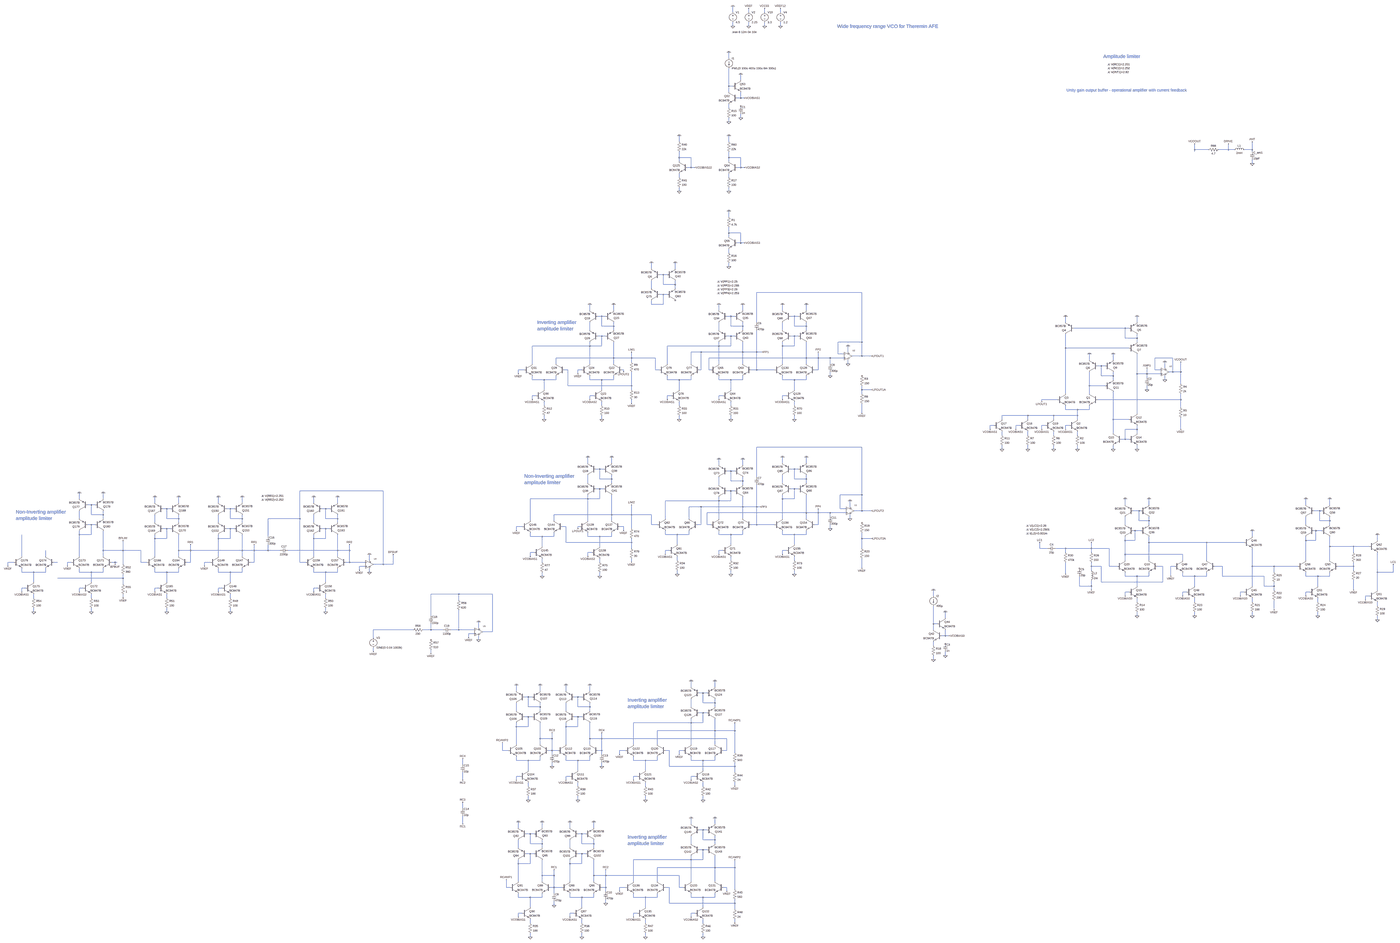
[diagram p0: schematic vco_sine_bjt_v10.asc, whole sheet]
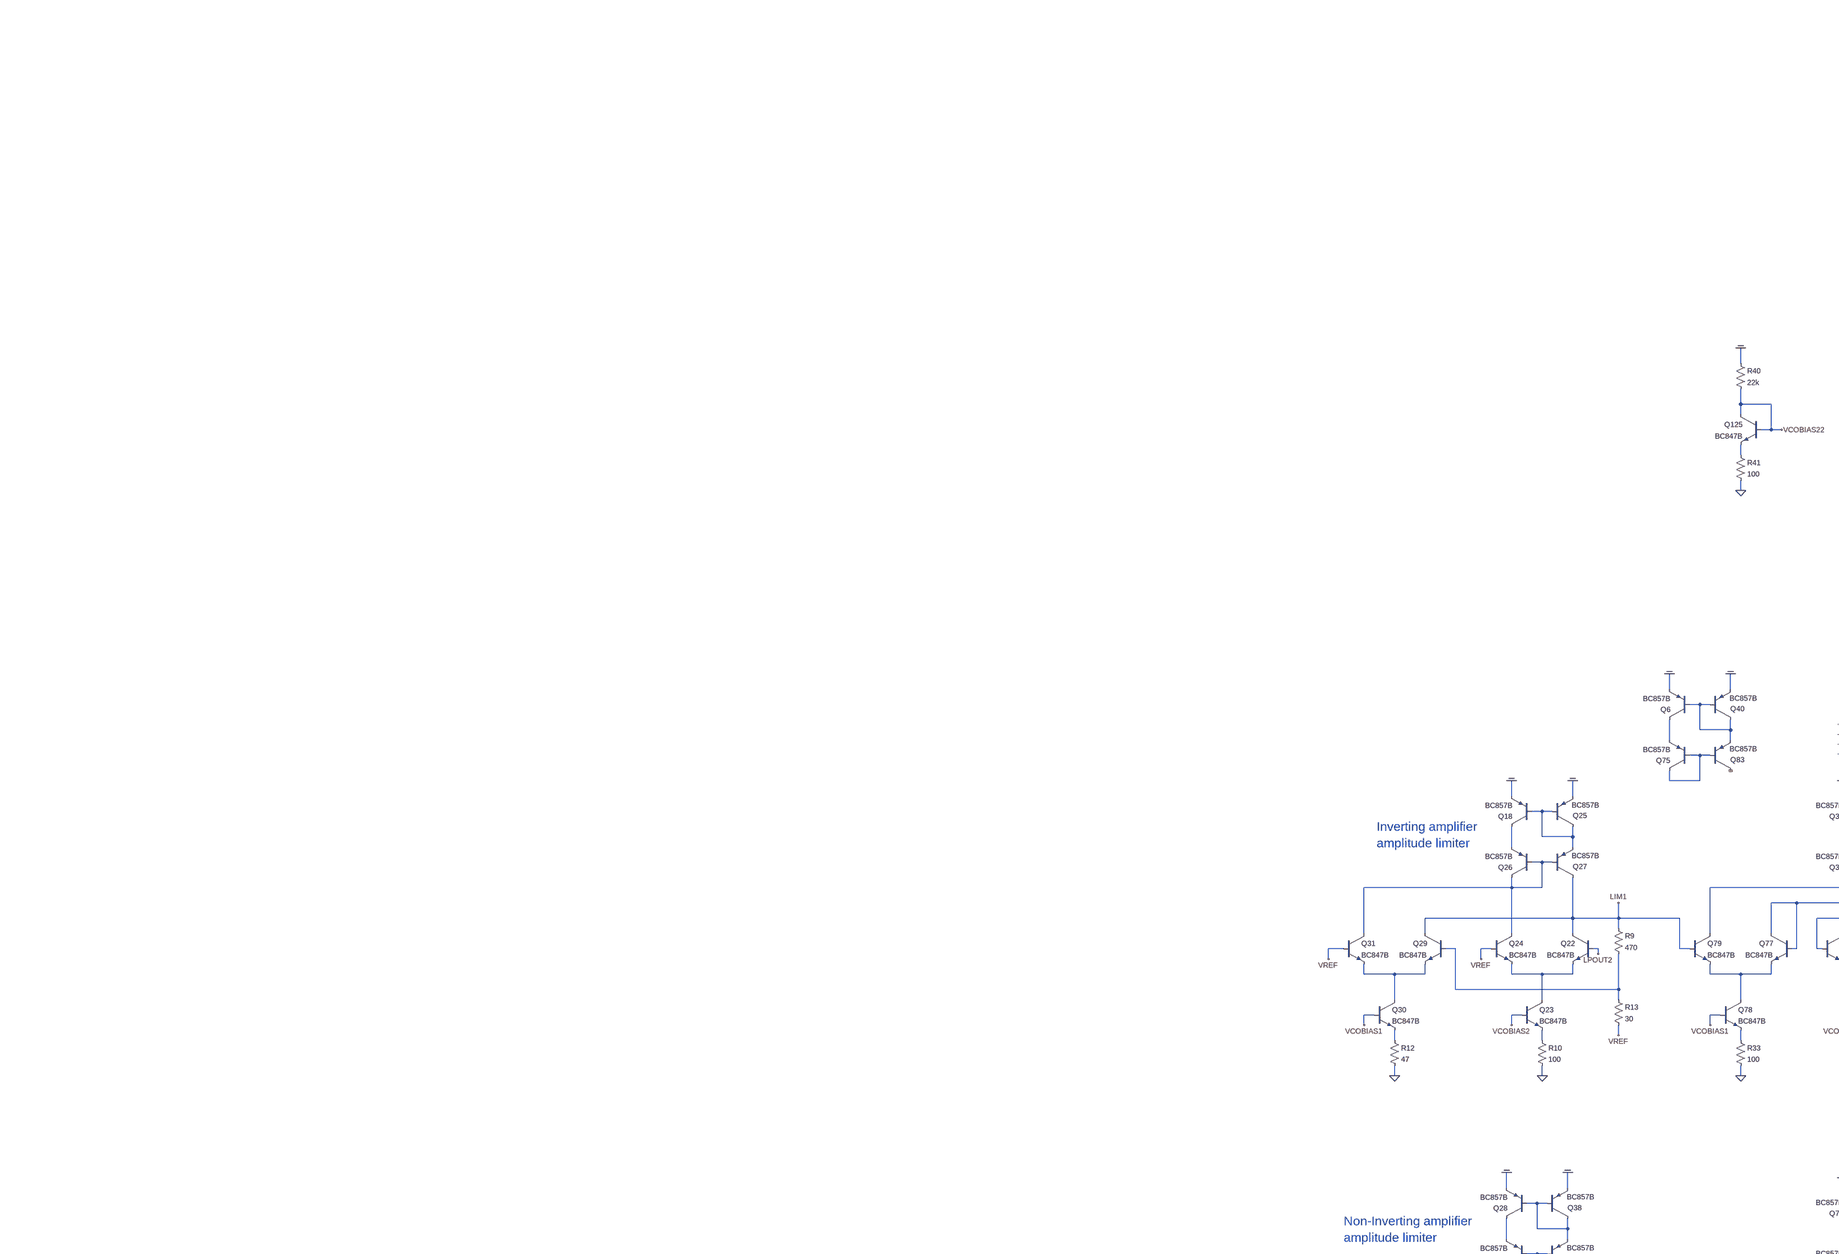
[diagram p1: schematic vco_sine_bjt_v10.asc, part, row 1 of 2, column 1 of 2]
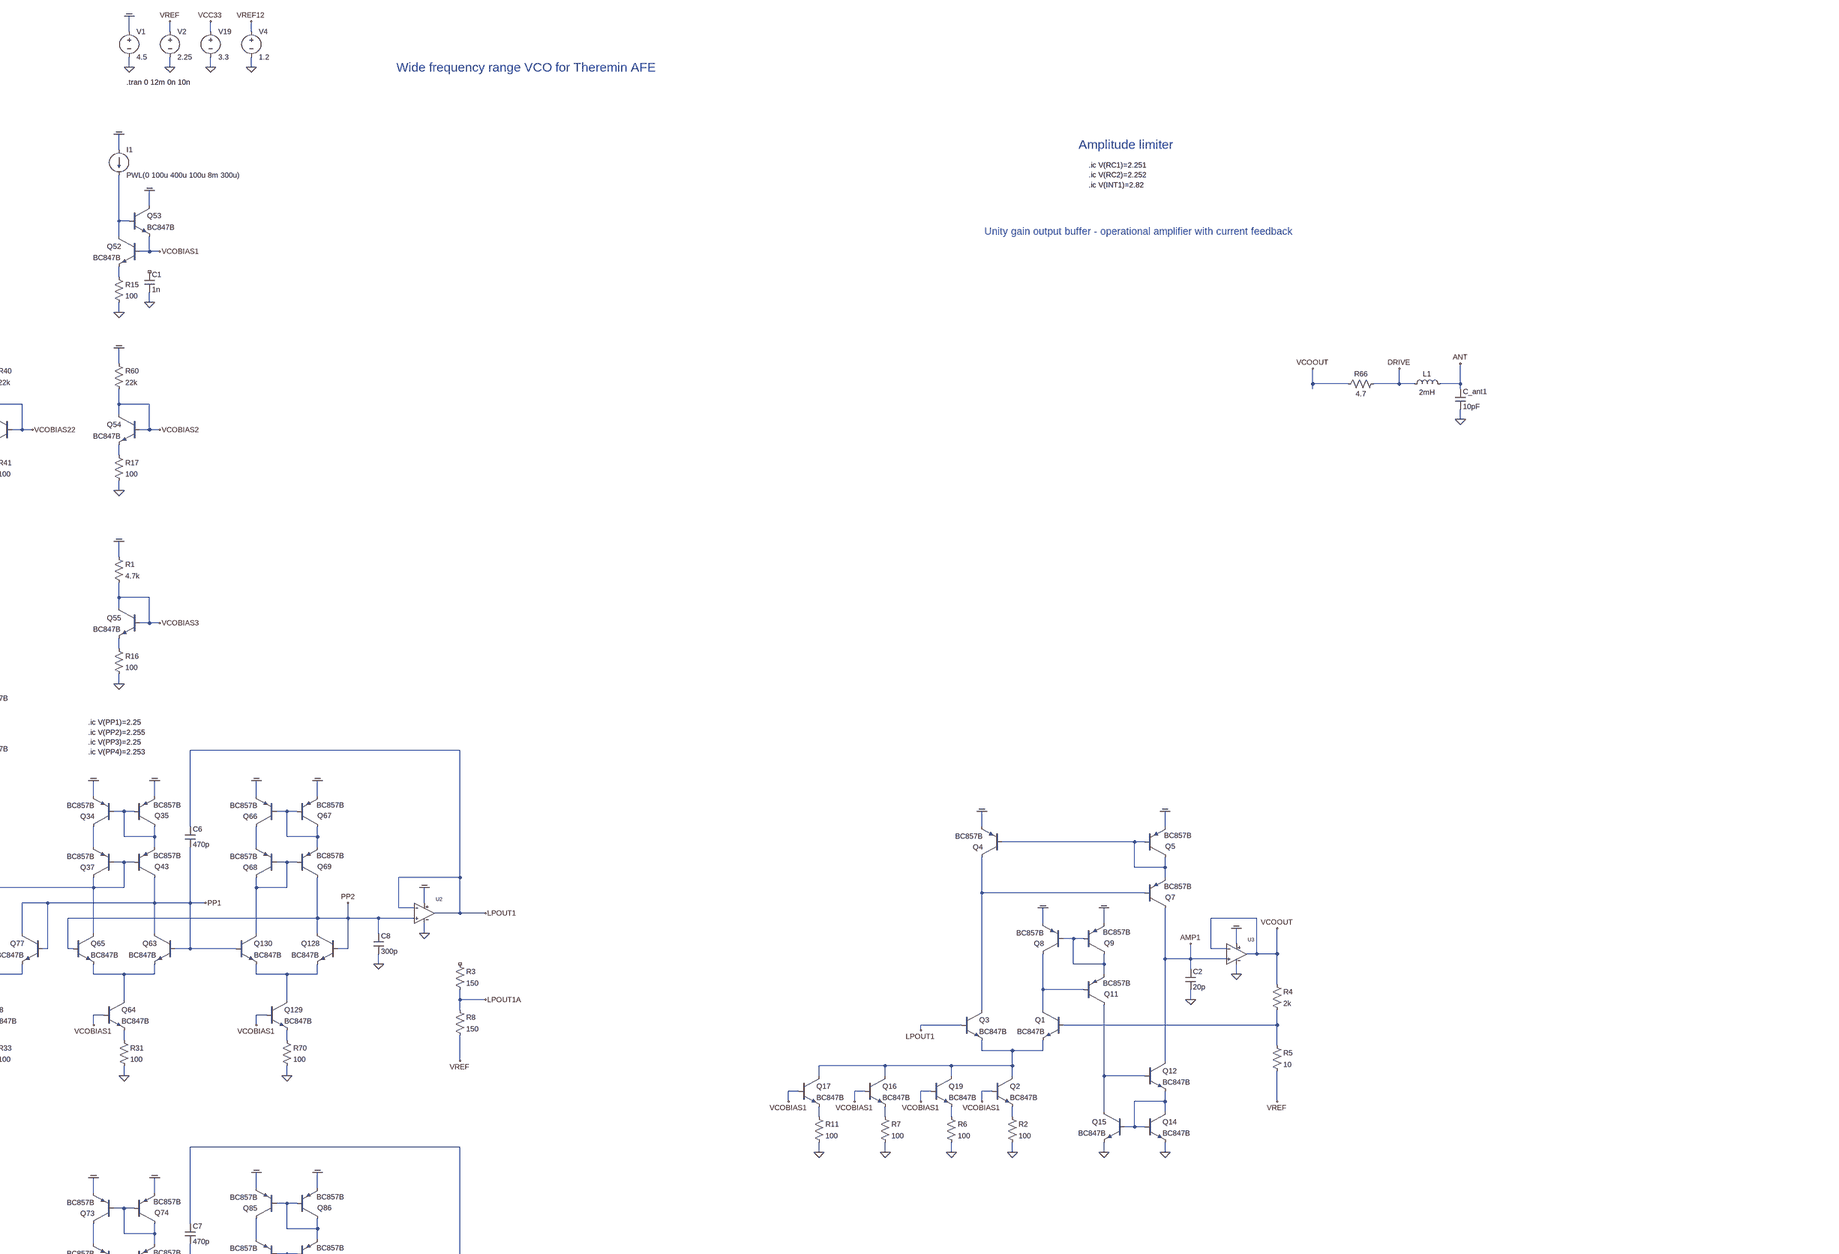
[diagram p2: schematic vco_sine_bjt_v10.asc, part, row 1 of 2, column 2 of 2]
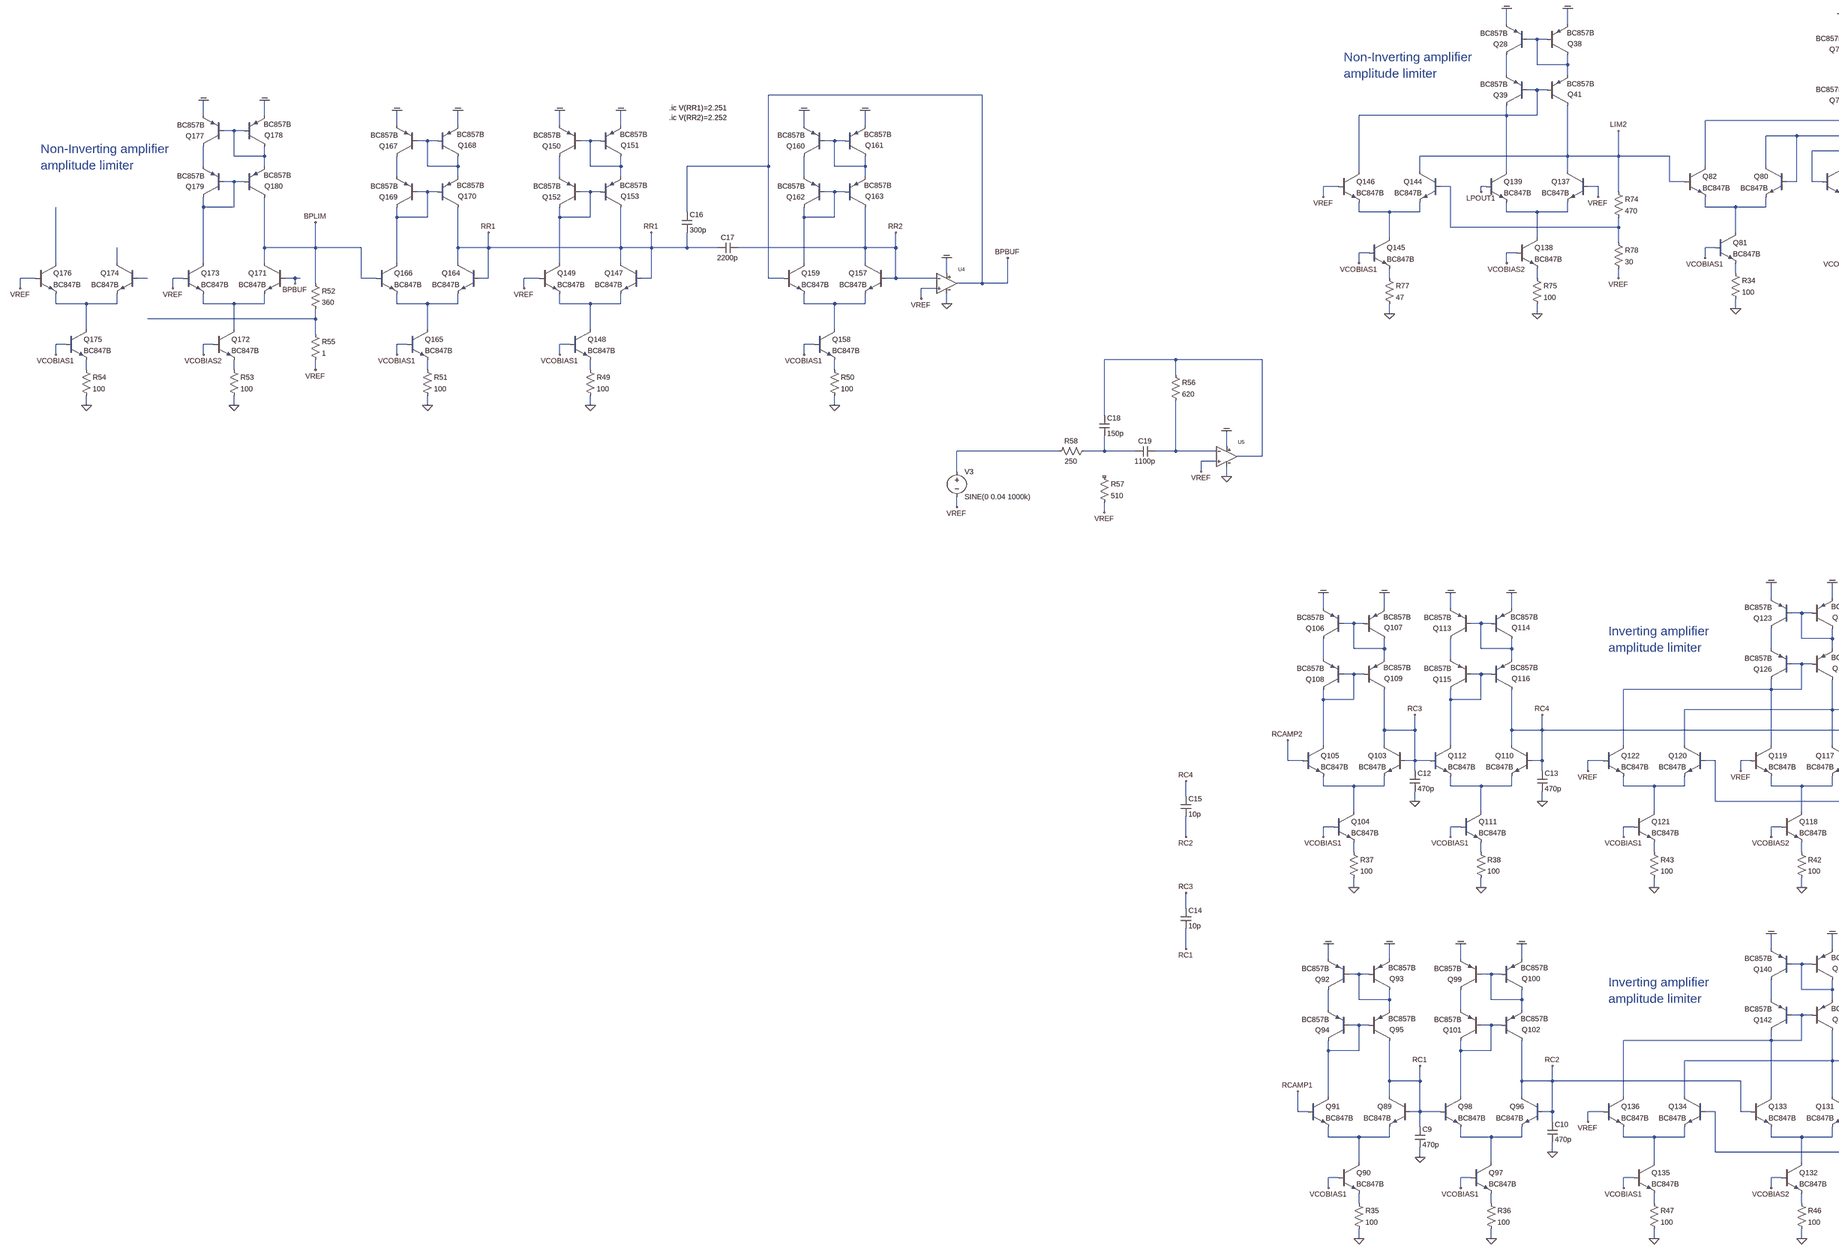
[diagram p3: schematic vco_sine_bjt_v10.asc, part, row 2 of 2, column 1 of 2]
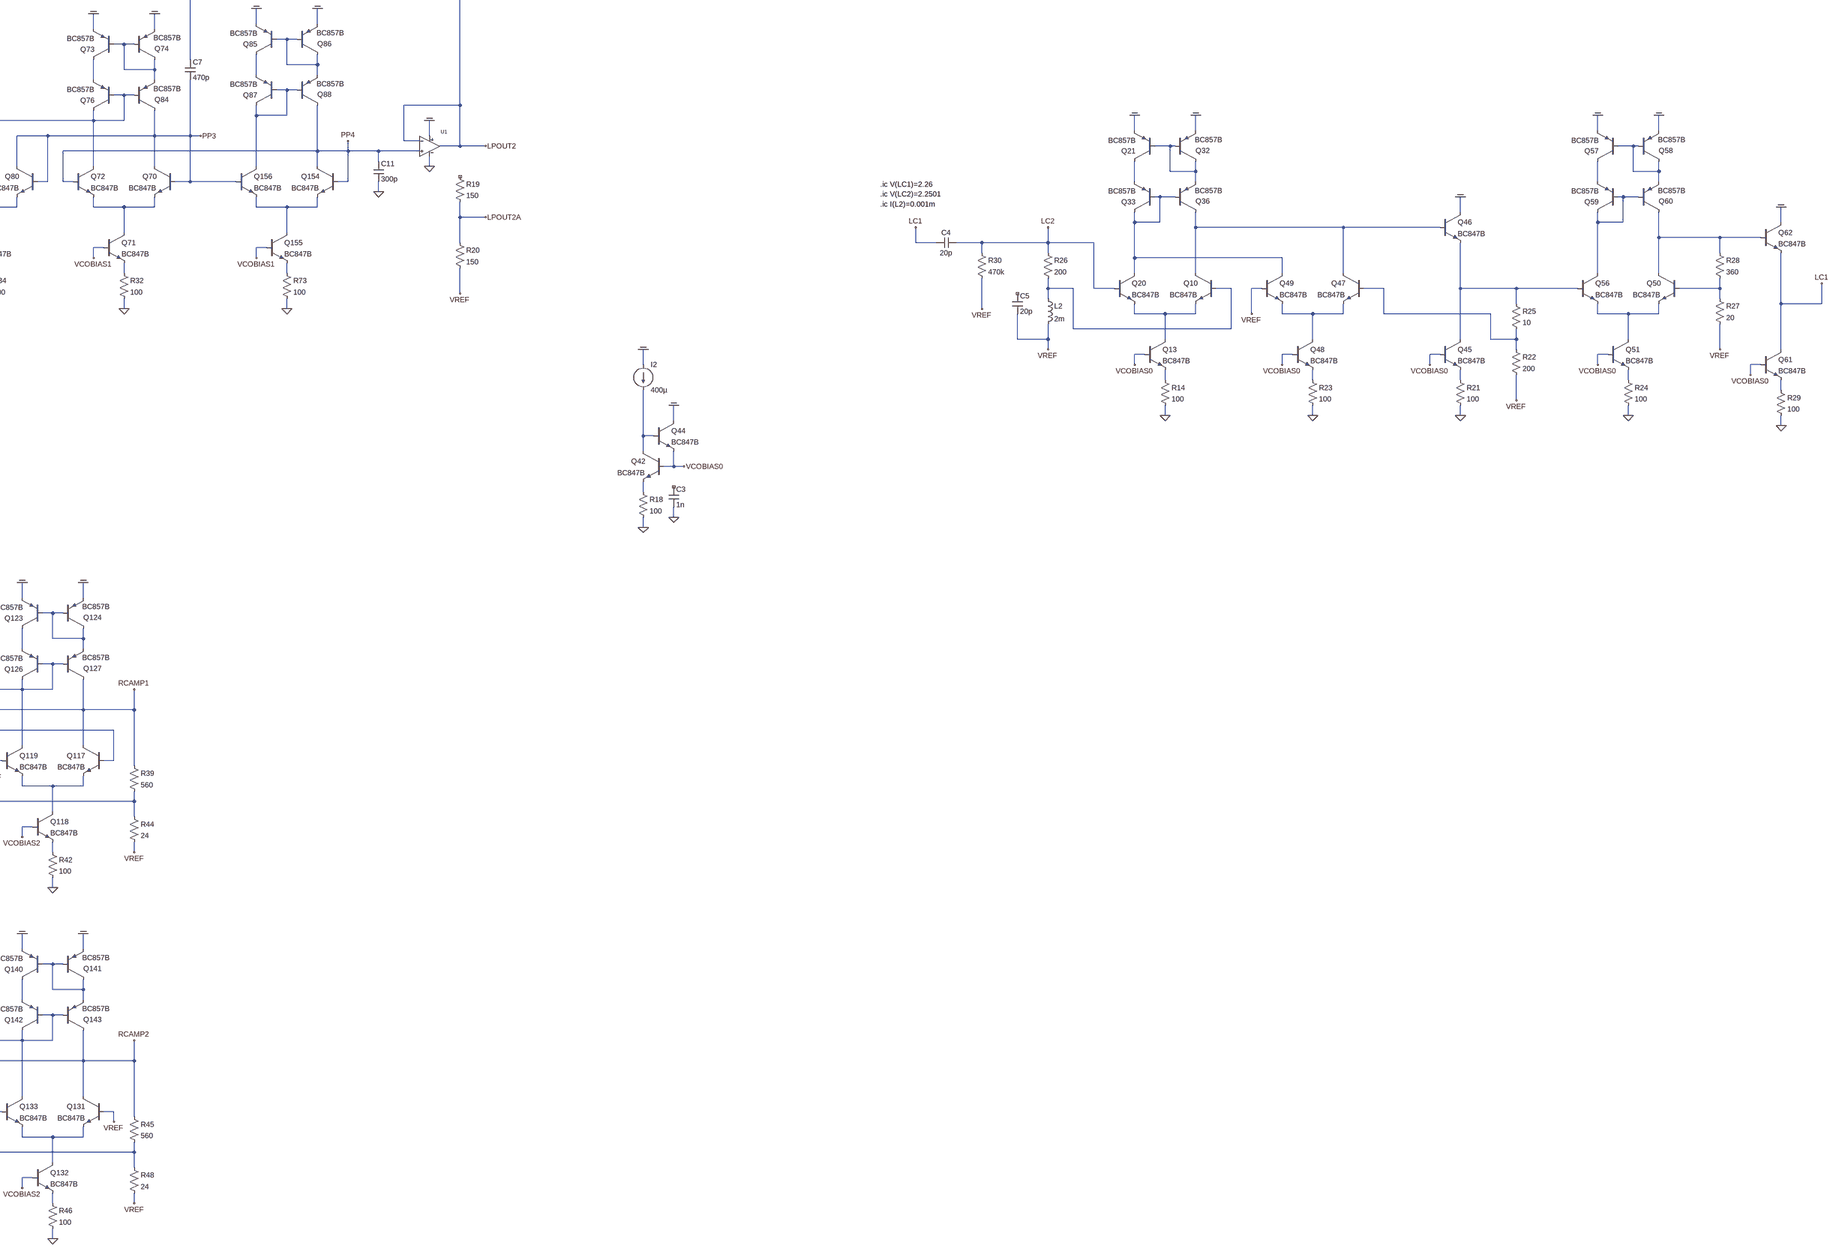
[diagram p4: schematic vco_sine_bjt_v10.asc, part, row 2 of 2, column 2 of 2]
* vco_sine_bjt_v10.asc
V1 COM 0 4.5
V2 VREF 0 2.25
V19 VCC33 0 3.3
V4 VREF12 0 1.2
Q52 N001 VCOBIAS1 N002 0 BC847B
R60 COM VCOBIAS2 22k
R1 COM VCOBIAS3 4.7k
I1 COM N001 PWL(0 100u 400u 100u 8m 300u)
Q54 VCOBIAS2 VCOBIAS2 N004 0 BC847B
Q55 VCOBIAS3 VCOBIAS3 N005 0 BC847B
Q53 COM N001 VCOBIAS1 0 BC847B
R15 N002 0 100
R16 N005 0 100
R17 N004 0 100
C1 NC_01 0 1n
R40 COM VCOBIAS22 22k
Q125 VCOBIAS22 VCOBIAS22 N003 0 BC847B
R41 N003 0 100
L1 DRIVE ANT 2mH Rser=120 Cpar=1pF
C_ant1 ANT 0 10pF
R66 VCOOUT DRIVE 4.7
Q128 PP2 PP2 N026 0 BC847B
Q129 N026 VCOBIAS1 N033 0 BC847B
Q130 N018 PP1 N026 0 BC847B
R70 N033 0 100
C8 PP2 0 300p
Q137 LIM2 VREF N073 0 BC847B
Q138 N073 VCOBIAS2 N083 0 BC847B
Q139 N047 LPOUT1 N073 0 BC847B
R74 LIM2 N063 470
R75 N083 0 100
Q144 LIM2 N063 N072 0 BC847B
Q145 N072 VCOBIAS1 N082 0 BC847B
Q146 N047 VREF N072 0 BC847B
R77 N082 0 47
R78 N063 VREF 30
Q154 PP4 PP4 N071 0 BC847B
Q155 N071 VCOBIAS1 N080 0 BC847B
Q156 N048 PP3 N071 0 BC847B
R73 N080 0 100
C11 PP4 0 300p
Q1 N027 N028 N034 0 BC847B
Q2 N034 VCOBIAS1 N040 0 BC847B
Q3 N019 LPOUT1 N034 0 BC847B
R2 N040 0 100
Q4 N019 N012 COM 0 BC857B
Q5 N012 N012 COM 0 BC857B
Q7 AMP1 N019 N012 0 BC857B
Q8 N027 N020 COM 0 BC857B
Q9 N020 N020 COM 0 BC857B
Q11 N035 N027 N020 0 BC857B
Q12 AMP1 N035 N036 0 BC847B
Q14 N036 N036 0 0 BC847B
Q15 N035 N036 0 0 BC847B
C2 AMP1 0 20p
R4 VCOOUT N028 2k
R5 N028 VREF 10
Q19 N034 VCOBIAS1 N039 0 BC847B
R6 N039 0 100
Q22 LIM1 LPOUT2 N023 0 BC847B
Q23 N023 VCOBIAS2 N030 0 BC847B
Q24 N016 VREF N023 0 BC847B
R9 LIM1 N021 470
R10 N030 0 100
Q29 LIM1 N021 N022 0 BC847B
Q30 N022 VCOBIAS1 N029 0 BC847B
Q31 N016 VREF N022 0 BC847B
R12 N029 0 47
R13 N021 VREF 30
XU1 PP4 LPOUT2 COM 0 LPOUT2 MCP6021  ; pins In+ In- V+ V- OUT
XU2 PP2 LPOUT1 COM 0 LPOUT1 MCP6021  ; pins In+ In- V+ V- OUT
XU3 AMP1 VCOOUT COM 0 VCOOUT MCP6021  ; pins In+ In- V+ V- OUT
R3 NC_02 LPOUT1A 150
R8 LPOUT1A VREF 150
Q16 N034 VCOBIAS1 N038 0 BC847B
R7 N038 0 100
Q17 N034 VCOBIAS1 N037 0 BC847B
R11 N037 0 100
R19 NC_03 LPOUT2A 150
R20 LPOUT2A VREF 150
Q10 N074 N084 N093 0 BC847B
Q13 N093 VCOBIAS0 N103 0 BC847B
Q20 N067 LC2 N093 0 BC847B
R14 N103 0 100
Q21 N061 N054 COM 0 BC857B
Q32 N054 N054 COM 0 BC857B
Q33 N067 N067 N061 0 BC857B
Q36 N074 N067 N054 0 BC857B
Q42 N108 VCOBIAS0 N112 0 BC847B
I2 COM N108 400µ
Q44 COM N108 VCOBIAS0 0 BC847B
R18 N112 0 100
C3 NC_04 0 1n
L2 N084 VREF 2m Rser=10 Cpar=1p
C4 LC2 LC1 20p
R26 LC2 N084 200
Q45 N086 VCOBIAS0 N105 0 BC847B
R21 N105 0 100
Q46 COM N074 N086 0 BC847B
Q47 N074 N085 N094 0 BC847B
Q48 N094 VCOBIAS0 N104 0 BC847B
Q49 N067 VREF N094 0 BC847B
R23 N104 0 100
Q50 N075 N087 N095 0 BC847B
Q51 N095 VCOBIAS0 N106 0 BC847B
Q56 N068 N086 N095 0 BC847B
R24 N106 0 100
Q57 N062 N055 COM 0 BC857B
Q58 N055 N055 COM 0 BC857B
Q59 N068 N068 N062 0 BC857B
Q60 N075 N068 N055 0 BC857B
R27 N087 VREF 20
R28 N075 N087 360
Q61 LC1 VCOBIAS0 N107 0 BC847B
R29 N107 0 100
Q62 COM N075 LC1 0 BC847B
R22 N085 VREF 200
R25 N086 N085 10
C5 NC_05 VREF 20p
R30 LC2 VREF 470k
Q63 PP1 PP1 N025 0 BC847B
Q64 N025 VCOBIAS1 N032 0 BC847B
Q65 N017 PP2 N025 0 BC847B
R31 N032 0 100
C6 LPOUT1 PP1 470p
Q70 PP3 PP3 N070 0 BC847B
Q71 N070 VCOBIAS1 N079 0 BC847B
Q72 N049 PP4 N070 0 BC847B
R32 N079 0 100
C7 LPOUT2 PP3 470p
Q77 PP1 PP1 N024 0 BC847B
Q78 N024 VCOBIAS1 N031 0 BC847B
Q79 N017 LIM1 N024 0 BC847B
R33 N031 0 100
Q80 PP3 PP3 N069 0 BC847B
Q81 N069 VCOBIAS1 N078 0 BC847B
Q82 N049 LIM2 N069 0 BC847B
R34 N078 0 100
Q6 N007 N006 COM 0 BC857B
Q40 N006 N006 COM 0 BC857B
Q75 N008 N008 N007 0 BC857B
Q83 NC_06 N008 N006 0 BC857B
Q18 N013 N009 COM 0 BC857B
Q25 N009 N009 COM 0 BC857B
Q26 N016 N016 N013 0 BC857B
Q27 LIM1 N016 N009 0 BC857B
Q34 N014 N010 COM 0 BC857B
Q35 N010 N010 COM 0 BC857B
Q37 N017 N017 N014 0 BC857B
Q43 PP1 N017 N010 0 BC857B
Q66 N015 N011 COM 0 BC857B
Q67 N011 N011 COM 0 BC857B
Q68 N018 N018 N015 0 BC857B
Q69 PP2 N018 N011 0 BC857B
Q28 N044 N041 COM 0 BC857B
Q38 N041 N041 COM 0 BC857B
Q39 N047 N047 N044 0 BC857B
Q41 LIM2 N047 N041 0 BC857B
Q73 N046 N043 COM 0 BC857B
Q74 N043 N043 COM 0 BC857B
Q76 N049 N049 N046 0 BC857B
Q84 PP3 N049 N043 0 BC857B
Q85 N045 N042 COM 0 BC857B
Q86 N042 N042 COM 0 BC857B
Q87 N048 N048 N045 0 BC857B
Q88 PP4 N048 N042 0 BC857B
Q89 RC1 RC1 N141 0 BC847B
Q90 N141 VCOBIAS1 N145 0 BC847B
Q91 N138 RCAMP1 N141 0 BC847B
R35 N145 0 100
C9 RC1 0 470p
Q92 N135 N132 COM 0 BC857B
Q93 N132 N132 COM 0 BC857B
Q94 N138 N138 N135 0 BC857B
Q95 RC1 N138 N132 0 BC857B
Q96 RC2 RC2 N142 0 BC847B
Q97 N142 VCOBIAS1 N146 0 BC847B
Q98 N139 RC1 N142 0 BC847B
R36 N146 0 100
C10 RC2 0 470p
Q99 N136 N133 COM 0 BC857B
Q100 N133 N133 COM 0 BC857B
Q101 N139 N139 N136 0 BC857B
Q102 RC2 N139 N133 0 BC857B
Q103 RC3 RC3 N123 0 BC847B
Q104 N123 VCOBIAS1 N127 0 BC847B
Q105 N120 RCAMP2 N123 0 BC847B
R37 N127 0 100
C12 RC3 0 470p
Q106 N117 N114 COM 0 BC857B
Q107 N114 N114 COM 0 BC857B
Q108 N120 N120 N117 0 BC857B
Q109 RC3 N120 N114 0 BC857B
Q110 RC4 RC4 N124 0 BC847B
Q111 N124 VCOBIAS1 N128 0 BC847B
Q112 N121 RC3 N124 0 BC847B
R38 N128 0 100
C13 RC4 0 470p
Q113 N118 N115 COM 0 BC857B
Q114 N115 N115 COM 0 BC857B
Q115 N121 N121 N118 0 BC857B
Q116 RC4 N121 N115 0 BC857B
Q117 RCAMP1 RC4 N126 0 BC847B
Q118 N126 VCOBIAS2 N130 0 BC847B
Q119 N119 VREF N126 0 BC847B
R39 RCAMP1 N122 560
R42 N130 0 100
Q120 RCAMP1 N122 N125 0 BC847B
Q121 N125 VCOBIAS1 N129 0 BC847B
Q122 N119 VREF N125 0 BC847B
R43 N129 0 100
R44 N122 VREF 24
Q123 N116 N113 COM 0 BC857B
Q124 N113 N113 COM 0 BC857B
Q126 N119 N119 N116 0 BC857B
Q127 RCAMP1 N119 N113 0 BC857B
Q131 RCAMP2 VREF N144 0 BC847B
Q132 N144 VCOBIAS2 N148 0 BC847B
Q133 N137 RC2 N144 0 BC847B
R45 RCAMP2 N140 560
R46 N148 0 100
Q134 RCAMP2 N140 N143 0 BC847B
Q135 N143 VCOBIAS1 N147 0 BC847B
Q136 N137 VREF N143 0 BC847B
R47 N147 0 100
R48 N140 VREF 24
Q140 N134 N131 COM 0 BC857B
Q141 N131 N131 COM 0 BC857B
Q142 N137 N137 N134 0 BC857B
Q143 RCAMP2 N137 N131 0 BC857B
C14 RC3 RC1 10p
C15 RC4 RC2 10p
XU4 VREF RR2 COM 0 BPBUF MCP6021  ; pins In+ In- V+ V- OUT
Q147 RR1 RR1 N091 0 BC847B
Q148 N091 VCOBIAS1 N101 0 BC847B
Q149 N065 VREF N091 0 BC847B
R49 N101 0 100
Q150 N058 N052 COM 0 BC857B
Q151 N052 N052 COM 0 BC857B
Q152 N065 N065 N058 0 BC857B
Q153 RR1 N065 N052 0 BC857B
Q157 RR2 RR2 N092 0 BC847B
Q158 N092 VCOBIAS1 N102 0 BC847B
Q159 N066 BPBUF N092 0 BC847B
R50 N102 0 100
Q160 N059 N053 COM 0 BC857B
Q161 N053 N053 COM 0 BC857B
Q162 N066 N066 N059 0 BC857B
Q163 RR2 N066 N053 0 BC857B
Q164 RR1 RR1 N090 0 BC847B
Q165 N090 VCOBIAS1 N100 0 BC847B
Q166 N064 BPLIM N090 0 BC847B
R51 N100 0 100
Q167 N057 N051 COM 0 BC857B
Q168 N051 N051 COM 0 BC857B
Q169 N064 N064 N057 0 BC857B
Q170 RR1 N064 N051 0 BC857B
C16 BPBUF RR1 300p
C17 RR2 RR1 2200p
Q171 BPLIM BPBUF N089 0 BC847B
Q172 N089 VCOBIAS2 N099 0 BC847B
Q173 N060 VREF N089 0 BC847B
R52 BPLIM N096 360
R53 N099 0 100
Q174 N077 N081 N088 0 BC847B
Q175 N088 VCOBIAS1 N098 0 BC847B
Q176 N076 VREF N088 0 BC847B
R54 N098 0 100
R55 N096 VREF 1
Q177 N056 N050 COM 0 BC857B
Q178 N050 N050 COM 0 BC857B
Q179 N060 N060 N056 0 BC857B
Q180 BPLIM N060 N050 0 BC857B
XU5 VREF N111 COM 0 N097 MCP6021  ; pins In+ In- V+ V- OUT
C18 N097 N110 150p
C19 N111 N110 1100p
R56 N097 N111 620
R57 NC_07 VREF 510
R58 N110 N109 250
V3 N109 VREF SINE(0 0.04 1000k)
.model NPN NPN
.model PNP PNP
.lib standard.bjt
.tran 0 12m 0n 10n
* Wide frequency range VCO for Theremin AFE
.ic V(RC1)=2.251
.ic V(RC2)=2.252
.ic V(INT1)=2.82
* Amplitude limiter
* Unity gain output buffer - operational amplifier with current feedback
.ic V(PP1)=2.25
.ic V(PP2)=2.255
.ic V(PP3)=2.25
.ic V(PP4)=2.253
* Non-Inverting amplifier
* amplitude limiter
* Inverting amplifier
* amplitude limiter
.ic V(LC1)=2.26
.ic V(LC2)=2.2501
.ic I(L2)=0.001m
* Inverting amplifier
* amplitude limiter
* Inverting amplifier
* amplitude limiter
* Non-Inverting amplifier
* amplitude limiter
.ic V(RR1)=2.251
.ic V(RR2)=2.252
.lib MCP6021.cir
.backanno
.end